# Altium schematic sheet ethernet.SchDoc: Ethernet SPI Adapter
size Letter
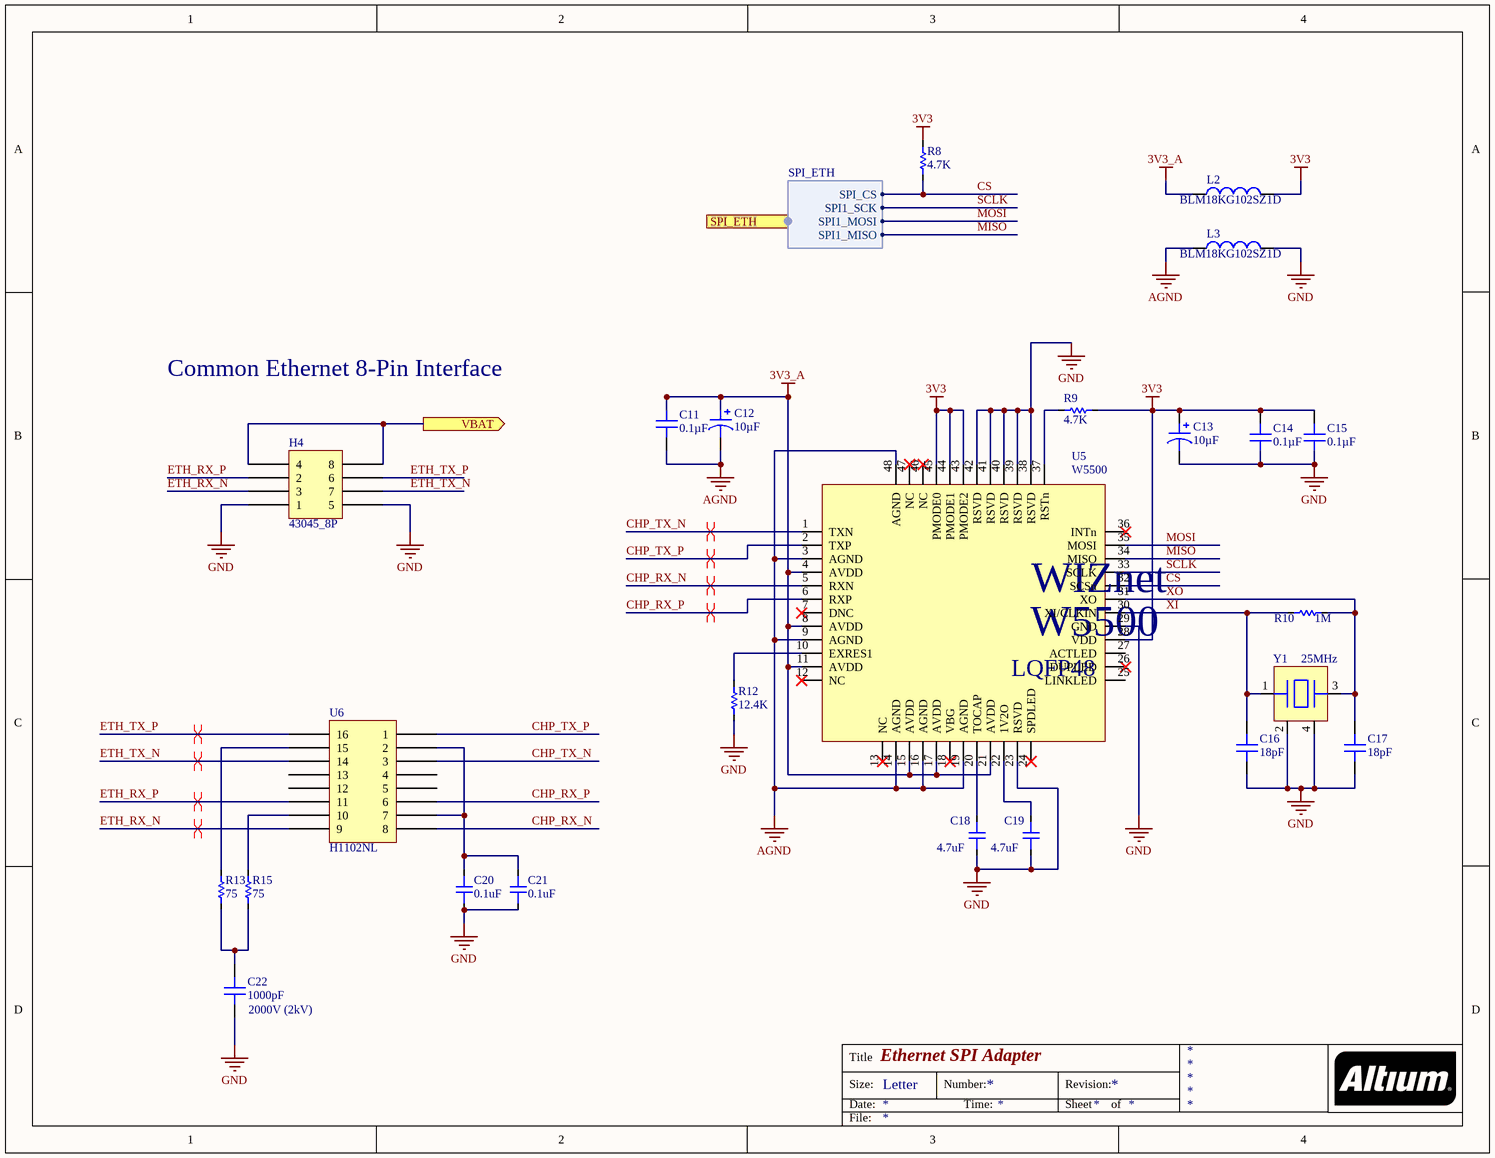
[diagram p0: ethernet.SchDoc]

## Parts
C11  0.1µF  [CAP 0603_1608]
C12  10µF  [CAP POL 1411_3528]
C13  10µF  [CAP POL 1411_3528]
C14  0.1µF  [CAP 0603_1608]
C15  0.1µF  [CAP 0603_1608]
C16  18pF  [CAP 0603_1608]
C17  18pF  [CAP 0603_1608]
C18  4.7uF  [CAP 0805 L]
C19  4.7uF  [CAP 0805 L]
C20  0.1uF  [CAP 0805 L]
C21  0.1uF  [CAP 0805 L]
C22  Voltage - Rated: 2000V (2kV)  [CAP 1206_3216 - 1.8MM]  (hidden comment: 1000pF)
H4  43045_8P  [MOLEX_43045_2X4]
L2  BLM18KG102SZ1D  [IND-0603]
L3  BLM18KG102SZ1D  [IND-0603]
R8  4.7K  [RES 0603 L]
R9  4.7K  [RES 0603 L]
R10  1M  [RES 0603 L]
R12  12.4K  [RES 0603 L]
R13  75  [RES 0603 L]
R15  75  [RES 0603 L]
U5  W5500  [WIZNET W5500]
U6  H1102NL  [H1102NL]
Y1  25MHz  [OSC-82J0626]

## Ports
SPI_ETH (harness SPI_ETH), VBAT (out)

## Harnesses
SPI_ETH: SPI1_MISO, SPI1_MOSI, SPI1_SCK, SPI_CS

## Nets
3V3: C13.1 C14.2 C15.2 L2.2 R8.2 R9.2 U5.28(VDD) U5.43(PMODE2) U5.44(PMODE1) U5.45(PMODE0)
3V3_A: C11.2 C12.1 L2.1 U5.4(AVDD) U5.8(AVDD) U5.11(AVDD) U5.15(AVDD) U5.17(AVDD) U5.21(AVDD)
AGND: C11.1 C12.2 L3.1 U5.3(AGND) U5.9(AGND) U5.14(AGND) U5.16(AGND) U5.19(AGND) U5.48(AGND)
GND: C13.2 C14.1 C15.1 C16.1 C17.1 C18.1 C19.1 C20.1 C21.1 C22.1 H4.1 H4.5 L3.2 R12.1 U5.23(RSVD) U5.29(GND) U5.38(RSVD) U5.39(RSVD) U5.40(RSVD) U5.41(RSVD) U5.42(RSVD) Y1.2 Y1.4
CHP_RX_N: U5.5(RXN) U6.8
CHP_RX_P: U5.6(RXP) U6.6
CHP_TX_N: U5.1(TXN) U6.3
CHP_TX_P: U5.2(TXP) U6.1
CS: R8.1 U5.32(SCSn) ; port SPI_ETH.SPI_CS
ETH_RX_N: H4.3 U6.9
ETH_RX_P: H4.2 U6.11
ETH_TX_N: H4.7 U6.14
ETH_TX_P: H4.6 U6.16
MISO: U5.34(MISO) ; port SPI_ETH.SPI1_MISO
MOSI: U5.35(MOSI) ; port SPI_ETH.SPI1_MOSI
SCLK: U5.33(SCLK) ; port SPI_ETH.SPI1_SCK
VBAT: H4.4 H4.8 ; port VBAT
XI: C16.2 R10.1 U5.30(XI/CLKIN) Y1.1
XO: C17.2 R10.2 U5.31(XO) Y1.3
NetC18_2: C18.2 U5.20(TOCAP)
NetC19_2: C19.2 U5.22(1V2O)
NetC20_2: C20.2 C21.2 U6.2 U6.7
NetC22_2: C22.2 R13.1 R15.1
NetR9_1: R9.1 U5.37(RSTn)
NetR12_2: R12.2 U5.10(EXRES1)
NetR13_2: R13.2 U6.15
NetR15_2: R15.2 U6.10

Not connected (* = marked no-connect by the designer): U5 7(DNC)* 12(NC)* 13(NC)* 18(VBG)* 24(SPDLED)* 25(LINKLED) 26(DUPLED)* 27(ACTLED) 36(INTn)* 46(NC)* 47(NC)*; U6 4 5 12 13

## Layout directives
differential pair: CHP_RX_N, CHP_RX_P, CHP_TX_N, CHP_TX_P, ETH_RX_N, ETH_RX_P, ETH_TX_N, ETH_TX_P

## Notes on the sheet
- Common Ethernet 8-Pin Interface
- Title
- Size:
- Date:
- Letter
- Number:
- Time:
- Revision:
- Sheet
- of
- File:
- (in symbol W5500) WIZnet; LQFP48

## Library data of the parts
C11 C14 C15 = C0603C104K5RACAUTO: CAP CER 0.1UF 50V X7R 0603; Manufacturer: KEMET; Tolerance: ±10%; Part Number: C0603C104K5RACAUTO; Value: 0.1µF; Applications: Automotive, Bypass, Decoupling; Capacitance: 0.1µF; ComponentLink1Description: Datasheet; ComponentLink1URL: https://api.kemet.com/component-edge/download/specsheet/C0603C104K5RACAUTO.pdf; ComponentLink2Description: DigiKey Link; ComponentLink2URL: http://digikey.com/product-detail/en/kemet/C0603C104K5RACAUTO/399-6856-1-ND/3314369; Device Package: 0603 (1608 Metric); LastUpdated: 2020-01-21 12:01:46 AM; Lifecycle Status: Active; Minimum Order: 1; Mounting Type: Surface Mount, MLCC; Operating Temperature: -55°C ~ 125°C; Package / Case: 0603 (1608 Metric); Packaging: TapeAndReel; PartId: 14977; Part Status: Active; Price: 0.03; Ratings: AEC-Q200; Series: SMD Auto X7R; Size / Dimension: 0.063" L x 0.031" W (1.60mm x 0.80mm); Supplier 1: DigiKey; Supplier Part Number 1: 399-6856-1-ND; Temperature Coefficient: X7R; Thickness (Max): 0.034" (0.87mm); Voltage - Rated: 50V
C12 C13 = T491B106K016ATAUTO: CAP TANT 10UF 10% 16V 1411; Manufacturer: KEMET; Manufacturer Size Code: B; ESR (Equivalent Series Resistance): 2.5Ohm; Lifetime @ Temp.: 2000 Hrs @ 125°C; Type: Molded; Part Number: T491B106K016ATAUTO; Value: 10µF; Capacitance: 10µF; ComponentLink1Description: Datasheet; ComponentLink1URL: https://api.kemet.com/component-edge/download/datasheet/T491B106K016ATAUTO.pdf; ComponentLink2Description: DigiKey Link; ComponentLink2URL: http://digikey.com/product-detail/en/kemet/T491B106K016ATAUTO/399-18036-1-ND/9342305; Device Package: 1411 (3528 Metric); Features: Automotive; Height - Seated (Max): 0.083" (2.10mm); LastUpdated: 2020-01-21 1:52:37 AM; Lifecycle Status: Active; Minimum Order: 1; Mounting Type: Surface Mount; Operating Temperature: -55°C ~ 125°C; Package / Case: 1411 (3528 Metric); Packaging: TapeAndReel; PartId: 1682; Part Status: Active; Price: 0.15; Ratings: AEC-Q200; Series: T491; Size / Dimension: 0.138" L x 0.110" W (3.50mm x 2.80mm); Supplier 1: DigiKey; Supplier Part Number 1: 399-18036-1-ND; Tolerance: ±10%; Voltage - Rated: 16V
C16 C17 = C0603C180J5GACAUTO: CAP CER 18PF 50V C0G/NP0 0603; Manufacturer: KEMET; Temperature Coefficient: C0G, NP0; Tolerance: ±5%; Part Number: C0603C180J5GACAUTO; Value: 18pF; Applications: Automotive; Capacitance: 18pF; ComponentLink1Description: Datasheet; ComponentLink1URL: https://api.kemet.com/component-edge/download/datasheet/C0603C180J5GACAUTO.pdf; ComponentLink2Description: DigiKey Link; ComponentLink2URL: http://digikey.com/product-detail/en/kemet/C0603C180J5GACAUTO/399-16019-1-ND/7516518; Device Package: 0603 (1608 Metric); Features: Low ESL; LastUpdated: 2020-01-21 12:01:53 AM; Lifecycle Status: Active; Minimum Order: 1; Mounting Type: Surface Mount, MLCC; Operating Temperature: -55°C ~ 125°C; Package / Case: 0603 (1608 Metric); Packaging: TapeAndReel; PartId: 12456; Part Status: Active; Price: 0.02; Ratings: AEC-Q200; Series: SMD Auto C0G; Size / Dimension: 0.063" L x 0.031" W (1.60mm x 0.80mm); Supplier 1: DigiKey; Supplier Part Number 1: 399-16019-1-ND; Thickness (Max): 0.034" (0.87mm); Voltage - Rated: 50V
C18 C19 = CAP 0805: Cap Ceramic 4.7uF 16V X7R 10% Pad SMD 0805 125C Automotive T/R; Manufacturer: KEMET; Manufacturer Part Number: C0805C475K4RACAUTO; Supplier 1: Digi-Key; Supplier Part Number 1: 399-15711-1-ND; Category: Ceramic Capacitors; Mount: Surface Mount; Case/Package: 0805; Case Code (Imperial): 0805; Case Code (Metric): 2012; Min Operating Temperature: -55°C; Max Operating Temperature: 125°C; Packaging: Cut Tape; Capacitance: 4.7uF; Tolerance: 10%; Voltage Rating: 16V; Ratings: AEC-Q200; ComponentLink1URL: http://www.farnell.com/datasheets/2741390.pdf?src-supplier=Farnell; ComponentLink1Description: http://www.farnell.com/datasheets/2741390.pdf?src-supplier=Farnell; ComponentLink2URL: http://www.farnell.com/datasheets/2741390.pdf?src-supplier=Newark; ComponentLink2Description: http://www.farnell.com/datasheets/2741390.pdf?src-supplier=Newark; ComponentLink3URL: http://www.farnell.com/datasheets/2741390.pdf?src-supplier=Element14; ComponentLink3Description: http://www.farnell.com/datasheets/2741390.pdf?src-supplier=Element14; ComponentLink4URL: https://api.kemet.com/component-edge/download/datasheet/C0805C475K4RACAUTO.pdf?src-supplier=Digi-Key; ComponentLink4Description: https://api.kemet.com/component-edge/download/datasheet/C0805C475K4RACAUTO.pdf?src-supplier=Digi-Key
C20 C21 = CAP 0805: Cap Ceramic 0.01uF 100V X7R 10% SMD 0805 125C Paper T/R; Manufacturer: KEMET; Manufacturer Part Number: C0805C103K1RACAUTO; Capacitance: 10nF; Supplier 1: Digi-Key; Supplier Part Number 1: 399-6922-1-ND; Category: Ceramic Capacitors; Mount: Surface Mount; Case/Package: 0805; Case Code (Metric): 2012; Case Code (Imperial): 0805; Dielectric Material: Ceramic; Contact Plating: Tin,Matte; Min Operating Temperature: -55°C; Max Operating Temperature: 125°C; Tolerance: 10%; Dielectric: X7R; Voltage Rating: 100V; Package Quantity: 1; Packaging: Tape and Reel; Voltage Rating (DC): 100V; Length: 2mm; Height: 0.78mm; Depth: 1.25mm; Width: 0.049inch; Thickness: 0.035inch; Ratings: AEC-Q200; Radiation Hardening: No; REACH SVHC: No SVHC; ComponentLink1URL: https://datasheet.ciiva.com/7842/1693454-7842169.pdf?src-supplier=Element14; ComponentLink1Description: https://datasheet.ciiva.com/7842/1693454-7842169.pdf?src-supplier=Element14
C22 = C1206C102KGRACAUTO: CAP CER 1000PF 2KV X7R 1206; Manufacturer: KEMET; Tolerance: ±10%; Part Number: C1206C102KGRACAUTO; Value: 1000pF; Applications: Automotive, Bypass, Decoupling; Capacitance: 1000pF; ComponentLink1Description: Datasheet; ComponentLink1URL: https://api.kemet.com/component-edge/download/datasheet/C1206C102KGRACAUTO.pdf; ComponentLink2Description: DigiKey Link; ComponentLink2URL: http://digikey.com/product-detail/en/kemet/C1206C102KGRACAUTO/399-12976-1-ND/5762258; Device Package: 1206 (3216 Metric); Features: Low ESL, High Voltage; LastUpdated: 2020-01-21 12:03:47 AM; Lifecycle Status: Active; Minimum Order: 1; Mounting Type: Surface Mount, MLCC; Operating Temperature: -55°C ~ 125°C; Package / Case: 1206 (3216 Metric); Packaging: TapeAndReel; PartId: 20361; Part Status: Active; Price: 0.06; Ratings: AEC-Q200; Series: SMD Auto X7R HV; Size / Dimension: 0.126" L x 0.063" W (3.20mm x 1.60mm); Supplier 1: DigiKey; Supplier Part Number 1: 399-12976-1-ND; Temperature Coefficient: X7R; Thickness (Max): 0.069" (1.75mm)
H4 = TERM_2x4P
L2 L3 = IND-0603: Ferrite Beads Multi-Layer Power 1KOhm 25% 100MHz 1A 200mOhm DCR 0603 Automotive T/R; Manufacturer: Murata; Number of Lines: 1; DC Resistance (DCR): 200mR; Supplier 1: Digi-Key; Supplier Part Number 1: 490-17350-1-ND; Manufacturer Part Number: BLM18KG102SZ1D; Mount: Surface Mount; Case/Package: 0603; Case Code (Imperial): 0603; Case Code (Metric): 1608; Min Operating Temperature: -55°C; Max Operating Temperature: 125°C; Packaging: Cut Tape; Max Current Rating: 1A; Ratings: AEC-Q200; ComponentLink1URL: https://www.murata.com/~/media/webrenewal/support/library/catalog/products/emc/emifil/c51e.ashx?la=en-us&src-supplier=Digi-Key; ComponentLink1Description: https://www.murata.com/~/media/webrenewal/support/library/catalog/products/emc/emifil/c51e.ashx?la=en-us&src-supplier=Digi-Key; ComponentLink2URL: https://www.murata.com/en-us/products/productdata/8796750610462/QNFA9122.pdf?src-supplier=Digi-Key; ComponentLink2Description: https://www.murata.com/en-us/products/productdata/8796750610462/QNFA9122.pdf?src-supplier=Digi-Key
R8 R9 = RES 0603: SMD Resistor, Thick film 4.7 kOhm,  ±  1 %, 0603, CRCW06034K70FKEA, Vishay; Resistance: 4.7kR; Tolerance: 1%; Temperature Coefficient: 100ppm/°C; Power Rating: 100mW; Voltage Rating: 75V; Supplier 1: Digi-Key; Supplier Part Number 1: 541-4.70KHCT-ND; Manufacturer: Vishay; Manufacturer Part Number: CRCW06034K70FKEA; Category: Chip SMD Resistors; Mount: Surface Mount; Case/Package: 0603; Weight: 7.1E-05oz; Contact Plating: Tin; Case Code (Imperial): 0603; Case Code (Metric): 1608; Min Operating Temperature: -55°C; Max Operating Temperature: 155°C; Composition: Thick Film; Termination: SMD/SMT; Packaging: Tape and Reel; Package Quantity: 5000; Military Standard: Not; Voltage Rating (DC): 75V; Length: 1.55mm; Height: 0.45mm; Width: 0.85mm; Depth: 0.85mm; Lead Free: Lead Free; REACH SVHC: Unknown; ComponentLink1URL: https://datasheet.ciiva.com/11809/0900766b80d98afc-11809859.pdf?src-supplier=RSComponents; ComponentLink1Description: https://datasheet.ciiva.com/11809/0900766b80d98afc-11809859.pdf?src-supplier=RSComponents; ComponentLink2URL: https://datasheet.ciiva.com/16520/dcrcwe3-16520616.pdf?src-supplier=Avnet+Asia; ComponentLink2Description: https://datasheet.ciiva.com/16520/dcrcwe3-16520616.pdf?src-supplier=Avnet+Asia; ComponentLink3URL: https://datasheet.ciiva.com/8079/1697337-8079646.pdf?src-supplier=Element14; ComponentLink3Description: https://datasheet.ciiva.com/8079/1697337-8079646.pdf?src-supplier=Element14; ComponentLink4URL: https://datasheet.ciiva.com/26314/fld-crcw-e3-data-en-26314735.pdf?src-supplier=Distrelec; ComponentLink4Description: https://datasheet.ciiva.com/26314/fld-crcw-e3-data-en-26314735.pdf?src-supplier=Distrelec; ComponentLink5URL: https://datasheet.ciiva.com/15159/getdatasheetpartid-33073-15159382.pdf?src-supplier=Verical; ComponentLink5Description: https://datasheet.ciiva.com/15159/getdatasheetpartid-33073-15159382.pdf?src-supplier=Verical; ComponentLink6URL: https://datasheet.ciiva.com/16199/dcrcwe3-16199366.pdf?src-supplier=Future+Electronics; ComponentLink6Description: https://datasheet.ciiva.com/16199/dcrcwe3-16199366.pdf?src-supplier=Future+Electronics; ComponentLink7URL: https://datasheet.ciiva.com/16764/70201119-16764918.pdf?src-supplier=Allied+Electronics; ComponentLink7Description: https://datasheet.ciiva.com/16764/70201119-16764918.pdf?src-supplier=Allied+Electronics; ComponentLink8URL: https://datasheet.ciiva.com/16724/70201119-16724106.pdf?src-supplier=Allied+Electronics; ComponentLink8Description: https://datasheet.ciiva.com/16724/70201119-16724106.pdf?src-supplier=Allied+Electronics
R10 = RES 0603: Thick Film Chip Resistor; Manufacturer: Vishay; Manufacturer Part Number: CRCW06031M00FKEA; Tolerance: 1%; Resistance: 1MR; Temperature Coefficient: 100ppm/°C; Power Rating: 100mW; Voltage Rating: 75V; Supplier 1: Digi-Key; Supplier Part Number 1: 541-1.00MHCT-ND; Category: Chip SMD Resistors; Mount: Surface Mount; Case/Package: 0603; Number of Pins: 2; Weight: 7.1E-05oz; Contact Plating: Tin; Case Code (Imperial): 0603; Case Code (Metric): 1608; Min Operating Temperature: -55°C; Max Operating Temperature: 155°C; Composition: Thick Film; Termination: SMD/SMT; Packaging: Tape and Reel; Package Quantity: 10; Number of Terminations: 2; Max Power Dissipation: 100mW; Features: Automotive AEC-Q200; Military Standard: Not; Voltage Rating (DC): 75V; Length: 1.55mm; Height: 0.45mm; Width: 0.85mm; Depth: 0.85mm; Radiation Hardening: No; Lead Free: Lead Free; REACH SVHC: Unknown; ComponentLink1URL: https://datasheet.ciiva.com/11809/0900766b80d98afc-11809074.pdf?src-supplier=RSComponents; ComponentLink1Description: https://datasheet.ciiva.com/11809/0900766b80d98afc-11809074.pdf?src-supplier=RSComponents; ComponentLink2URL: https://datasheet.ciiva.com/2465/dcrcwe3-2465549.pdf?src-supplier=Digi-Key; ComponentLink2Description: https://datasheet.ciiva.com/2465/dcrcwe3-2465549.pdf?src-supplier=Digi-Key; ComponentLink3URL: https://datasheet.ciiva.com/16311/dcrcwe3-16311533.pdf?src-supplier=Future+Electronics; ComponentLink3Description: https://datasheet.ciiva.com/16311/dcrcwe3-16311533.pdf?src-supplier=Future+Electronics; ComponentLink4URL: https://datasheet.ciiva.com/2465/dcrcwe3-2465550.pdf?src-supplier=Digi-Key; ComponentLink4Description: https://datasheet.ciiva.com/2465/dcrcwe3-2465550.pdf?src-supplier=Digi-Key; ComponentLink5URL: https://datasheet.ciiva.com/26314/fld-crcw-e3-data-en-26314645.pdf?src-supplier=Distrelec; ComponentLink5Description: https://datasheet.ciiva.com/26314/fld-crcw-e3-data-en-26314645.pdf?src-supplier=Distrelec; ComponentLink6URL: https://datasheet.ciiva.com/7841/1720486-7841822.pdf?src-supplier=Element14; ComponentLink6Description: https://datasheet.ciiva.com/7841/1720486-7841822.pdf?src-supplier=Element14; ComponentLink7URL: https://datasheet.ciiva.com/2465/dcrcwe3-2465551.pdf?src-supplier=Digi-Key; ComponentLink7Description: https://datasheet.ciiva.com/2465/dcrcwe3-2465551.pdf?src-supplier=Digi-Key; ComponentLink8URL: https://datasheet.ciiva.com/7841/125364-7841823.pdf?src-supplier=Element14; ComponentLink8Description: https://datasheet.ciiva.com/7841/125364-7841823.pdf?src-supplier=Element14
R12 = RES 0603: Res Thick Film 0603 12.4K Ohm 1% 1/10W ±100ppm/°C Molded SMD SMD Paper T/R; Manufacturer: Vishay; Manufacturer Part Number: CRCW0603-12K4FKEA; Resistance: 12.4kR; Power Rating: 100mW; Voltage Rating: 75V; Supplier 1: Digi-Key; Supplier Part Number 1: 541-12.4KHTR-ND; Category: Chip SMD Resistors; Mount: Surface Mount; Case/Package: 0603; Number of Pins: 2; Weight: 7.1E-05oz; Case Code (Imperial): 0603; Case Code (Metric): 1608; Contact Plating: Tin; Min Operating Temperature: -55°C; Max Operating Temperature: 155°C; Tolerance: 1%; Packaging: Tape and Reel; Package Quantity: 10; Termination: SMD/SMT; Composition: Thick Film; Temperature Coefficient: 100ppm/°C; Military Standard: Not; Voltage Rating (DC): 75V; Number of Terminations: 2; Max Power Dissipation: 100mW; Features: Automotive AEC-Q200; Length: 1.55mm; Height: 0.45mm; Width: 0.85mm; Depth: 0.85mm; Radiation Hardening: No; REACH SVHC: Unknown; Lead Free: Lead Free; ComponentLink1URL: https://datasheet.ciiva.com/11809/0900766b80d98afc-11809065.pdf?src-supplier=RSComponents; ComponentLink1Description: https://datasheet.ciiva.com/11809/0900766b80d98afc-11809065.pdf?src-supplier=RSComponents; ComponentLink2URL: https://datasheet.ciiva.com/16215/dcrcwe3-16215547.pdf?src-supplier=Future+Electronics; ComponentLink2Description: https://datasheet.ciiva.com/16215/dcrcwe3-16215547.pdf?src-supplier=Future+Electronics; ComponentLink3URL: https://datasheet.ciiva.com/16515/dcrcwe3-16515035.pdf?src-supplier=Avnet+Asia; ComponentLink3Description: https://datasheet.ciiva.com/16515/dcrcwe3-16515035.pdf?src-supplier=Avnet+Asia; ComponentLink4URL: https://datasheet.ciiva.com/2465/dcrcwe3-2465806.pdf?src-supplier=Digi-Key; ComponentLink4Description: https://datasheet.ciiva.com/2465/dcrcwe3-2465806.pdf?src-supplier=Digi-Key; ComponentLink5URL: https://datasheet.ciiva.com/16767/70201119-16767174.pdf?src-supplier=Allied+Electronics; ComponentLink5Description: https://datasheet.ciiva.com/16767/70201119-16767174.pdf?src-supplier=Allied+Electronics; ComponentLink6URL: https://datasheet.ciiva.com/5543/dcrcwe3-109170-5543127.pdf?src-supplier=Mouser; ComponentLink6Description: https://datasheet.ciiva.com/5543/dcrcwe3-109170-5543127.pdf?src-supplier=Mouser; ComponentLink7URL: https://datasheet.ciiva.com/16778/70201119-16778295.pdf?src-supplier=Allied+Electronics; ComponentLink7Description: https://datasheet.ciiva.com/16778/70201119-16778295.pdf?src-supplier=Allied+Electronics; ComponentLink8URL: https://datasheet.ciiva.com/3257/dcrcwe3-3257002.pdf?src-supplier=Avnet; ComponentLink8Description: https://datasheet.ciiva.com/3257/dcrcwe3-3257002.pdf?src-supplier=Avnet; ComponentLink9URL: https://datasheet.ciiva.com/2465/dcrcwe3-2465804.pdf?src-supplier=Digi-Key; ComponentLink9Description: https://datasheet.ciiva.com/2465/dcrcwe3-2465804.pdf?src-supplier=Digi-Key; ComponentLink10URL: https://datasheet.ciiva.com/2465/dcrcwe3-2465805.pdf?src-supplier=Digi-Key; ComponentLink10Description: https://datasheet.ciiva.com/2465/dcrcwe3-2465805.pdf?src-supplier=Digi-Key
R13 R15 = RES 0603: VISHAY - CRCW060375R0FKEA - RES, 75R, 1%, 0.1W, 0603, THICK FILM; Power Rating: 100mW; Temperature Coefficient: 100ppm/°C; Voltage Rating: 75V; Supplier 1: Digi-Key; Supplier Part Number 1: 541-75.0HCT-ND; Manufacturer: Vishay; Manufacturer Part Number: CRCW060375R0FKEA; Category: Chip SMD Resistors; Case/Package: 0603; Weight: 7.1E-05oz; Contact Plating: Tin; Case Code (Imperial): 0603; Case Code (Metric): 1608; Min Operating Temperature: -55°C; Max Operating Temperature: 155°C; Resistance: 75R; Tolerance: 1%; Composition: Thick Film; Packaging: Tape and Reel; Package Quantity: 5000; Termination: SMD/SMT; Number of Terminations: 2; Military Standard: Not; Voltage Rating (DC): 75V; Working Voltage: 75V; Length: 1.55mm; Height: 0.45mm; Width: 0.85mm; Depth: 0.85mm; Lead Free: Lead Free; REACH SVHC: Unknown; ComponentLink1URL: https://datasheet.ciiva.com/11809/0900766b80d98afc-11809100.pdf?src-supplier=RSComponents; ComponentLink1Description: https://datasheet.ciiva.com/11809/0900766b80d98afc-11809100.pdf?src-supplier=RSComponents; ComponentLink2URL: https://datasheet.ciiva.com/7673/1697337-7673323.pdf?src-supplier=Element14; ComponentLink2Description: https://datasheet.ciiva.com/7673/1697337-7673323.pdf?src-supplier=Element14; ComponentLink3URL: https://datasheet.ciiva.com/16852/dcrcwe3-16852747.pdf?src-supplier=Avnet+Europe; ComponentLink3Description: https://datasheet.ciiva.com/16852/dcrcwe3-16852747.pdf?src-supplier=Avnet+Europe; ComponentLink4URL: https://datasheet.ciiva.com/3257/dcrcwe3-3257884.pdf?src-supplier=Avnet; ComponentLink4Description: https://datasheet.ciiva.com/3257/dcrcwe3-3257884.pdf?src-supplier=Avnet; ComponentLink5URL: https://datasheet.ciiva.com/3257/dcrcwe3-3257885.pdf?src-supplier=Avnet; ComponentLink5Description: https://datasheet.ciiva.com/3257/dcrcwe3-3257885.pdf?src-supplier=Avnet; ComponentLink6URL: https://datasheet.ciiva.com/16780/70201119-16780254.pdf?src-supplier=Allied+Electronics; ComponentLink6Description: https://datasheet.ciiva.com/16780/70201119-16780254.pdf?src-supplier=Allied+Electronics; ComponentLink7URL: https://datasheet.ciiva.com/5541/dcrcwe3-109170-5541910.pdf?src-supplier=Mouser; ComponentLink7Description: https://datasheet.ciiva.com/5541/dcrcwe3-109170-5541910.pdf?src-supplier=Mouser; ComponentLink8URL: https://datasheet.ciiva.com/16199/dcrcwe3-16199141.pdf?src-supplier=Future+Electronics; ComponentLink8Description: https://datasheet.ciiva.com/16199/dcrcwe3-16199141.pdf?src-supplier=Future+Electronics; ComponentLink9URL: https://datasheet.ciiva.com/16722/70201119-16722522.pdf?src-supplier=Allied+Electronics; ComponentLink9Description: https://datasheet.ciiva.com/16722/70201119-16722522.pdf?src-supplier=Allied+Electronics; ComponentLink10URL: https://datasheet.ciiva.com/7673/1697337-7673471.pdf?src-supplier=Element14; ComponentLink10Description: https://datasheet.ciiva.com/7673/1697337-7673471.pdf?src-supplier=Element14
U5 = W5500: WIZnet W5500
Y1 = OSC-82J0626-25MHz: CRYSTAL 25.0000MHZ 18PF SMD; Manufacturer: Epson; Manufacturer Part Number: FA-23825.0000MB-C3; Frequency Tolerance: 50ppm; ESR (Equivalent Series Resistance): 50R; Frequency Stability: 30ppm; Supplier 1: Digi-Key; Supplier Part Number 1: SER3691CT-ND; Category: Crystals; Mount: Surface Mount; Case/Package: SMD/SMT; Weight: 0.000564oz; Min Operating Temperature: -20°C; Max Operating Temperature: 70°C; Frequency: 25MHz; Load Capacitance: 18pF; Package Quantity: 250; Packaging: Tape and Reel; Tolerance: 50ppm; Termination: SMD/SMT; Length: 0.126inch; Height: 0.028inch; Width: 0.098inch; Lead Free: Lead Free; ComponentLink1URL: http://www.mouser.com/ds/2/137/A-238_en-932914.pdf?src-supplier=Mouser; ComponentLink1Description: http://www.mouser.com/ds/2/137/A-238_en-932914.pdf?src-supplier=Mouser; ComponentLink2URL: https://www5.epsondevice.com/en/information/support/pdf/june_2018_psc_masterbook.pdf?src-supplier=Digi-Key; ComponentLink2Description: https://www5.epsondevice.com/en/information/support/pdf/june_2018_psc_masterbook.pdf?src-supplier=Digi-Key